# EAGLE design JFETTester (EAGLE 6.4)
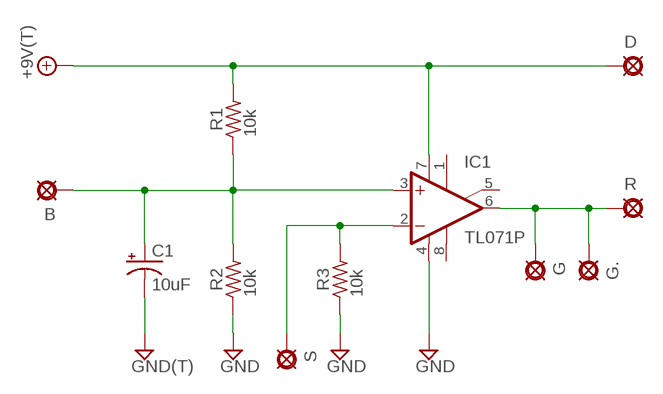
[diagram p0: schematic, sheet 1]

## Parts
+9V  +9V(T)  [SQUARE]
B  PAD  [SQUARE]
C1  10uF  0501  [050_020_1]
D  PAD  [SQUARE]
G  PAD  [SQUARE]
G.  PAD  [SQUARE]
GND  GND(T)  [SQUARE]
IC1  TL071P  [DIL08]
R  PAD  [SQUARE]
R1  10k  6MM.1  [R0207/1V]
R2  10k  6MM.1  [R0207/1V]
R3  10k  6MM.1  [R0207/1V]
S  PAD  [SQUARE]

## Nets
+9V: +9V.1(+9V) D.1(PAD) IC1.7(V+) R1.2
GND: C1.- GND.1(GND) IC1.4(V-) R2.1 R3.1
N$1: B.1(PAD) C1.+ IC1.3(+IN) R1.1 R2.2
N$2: IC1.2(-IN) R3.2 S.1(PAD)
N$3: G.1(PAD) G..1(PAD) IC1.6(OUT) R.1(PAD)
Unconnected: IC1.1(ON1) IC1.5(ON2) IC1.8(OPT)

## Library data of the parts
+9V = mb_supply:+9V(T): +9V Voltage Supply use this to hook up +9v throughout a schematic instead of running wire automatically labels the net "+9v" adds a hookup pad to the circuit board
B D G G. R S = mb_supply:PAD: PAD use this package for pads with any purpose, including input, output, send or return various pad shapes: round, square, octogonal, long, and long offset
C1 = mb_caps-electro:050: 0.22 - 100uF Xicon values at Mouser.com: 10V: 10 - 100uF; 16V: 2.2 - 47uF; 25V: 0.47 - 47uF; 50V: 0.22 - 22uF
GND = mb_supply:GND(T): Ground use this to hook up ground (GND) throughout a schematic instead of running wire automatically labels the net "GND" adds a hookup pad to the circuit board (you can use several)
IC1 = mb_ics:TL071: OP AMP
R1-R3 = mb_resistors:6MM: 6mm Resistors Leads spaced 1-6 holes apart for 0.1" perfboard. Suitable for 1/4 watt resistors.

## Board
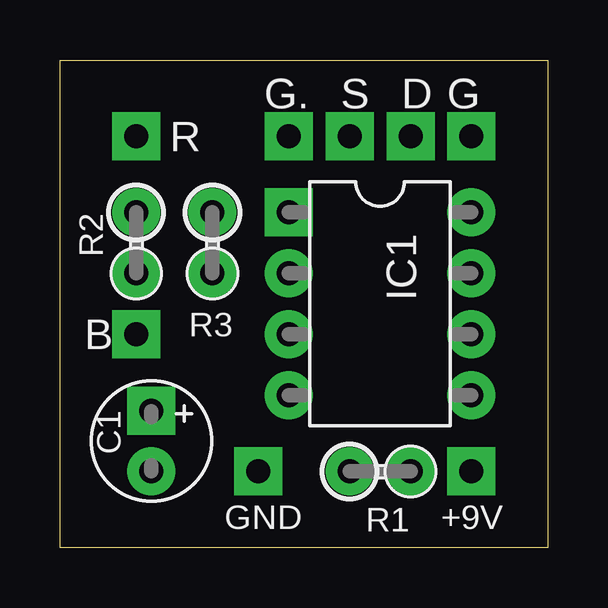
[diagram p1: board, top side]
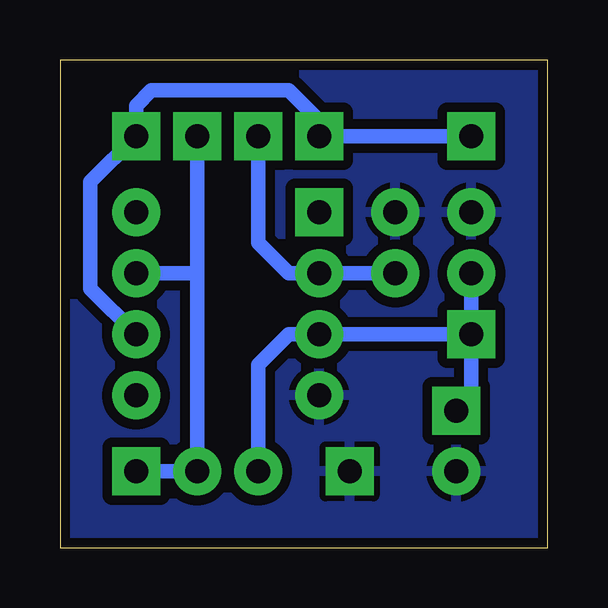
[diagram p2: board, bottom side, seen from below]

Size 20.32 x 20.32 mm. Coordinates in mm from the lower left corner, seen from the top.
Outline: 0,0 0,20.32 20.32,20.32 20.32,0 0,0
Copper layers (1*16): Top 0.0356mm / dielectric 1.5011mm / Bottom 0.0356mm
Design rules "LaenPCBOrder": minimum track width 6mil, minimum drill 13mil, track to track 6mil, track to pad 6mil, pad to pad 6mil, via to via 6mil, smd to smd 6mil, copper to edge 15mil, drill to drill 6mil, minimum pad ring 7mil, minimum via ring 7mil, stop-mask expansion 3mil, vias tented up to drill 0mil, thermal gap 10mil

### Footprints (pad centres in the part's own frame; a part is rotated, then mirrored left to right if it is on the bottom)
SQUARE = drill 1 pad 2 square: 1 0,0
050_020_1 = drill 1 pad 2 square: + -1.27,0 | drill 1 pad 2: - 1.27,0
DIL08 = drill 1 pad 2 square: 1 -3.81,-3.81 | drill 1 pad 2: 2 -1.27,-3.81; 3 1.27,-3.81; 4 3.81,-3.81; 5 3.81,3.81; 6 1.27,3.81; 7 -1.27,3.81; 8 -3.81,3.81
R0207/1V = drill 1 pad 2: 1 -1.27,0; 2 1.27,0

### Placement (x,y rotation side)
+9V  17.15,3.17 0 top
B  3.17,8.89 0 top
C1  3.81,4.45 270 top
D  14.6,17.14 0 top
G  17.15,17.14 0 top
G.  9.52,17.14 0 top
GND  8.25,3.17 0 top
IC1  13.34,10.16 270 top
R  3.17,17.14 0 top
R1  13.34,3.17 0 top
R2  3.17,12.7 270 top
R3  6.35,12.7 270 top
S  12.06,17.14 0 top

### Tracks (layer width: path | path; a pad name or v marks a point on that pad's centre or on a via)
+9V
  Bottom 0.61: 14.6,11.43 R1.2 +9V.1 | 14.6,11.43 D.1 | IC1.7 14.6,11.43
GND
  pour Bottom (isolate 0.406): 0,20.32 20.32,20.32 20.32,0 0,0
N$1
  Bottom 0.61: C1.+ 3.17,6.35 B.1 | R2.2 B.1 | R1.1 12.06,7.62 10.79,8.89 IC1.3 B.1
N$2
  Bottom 0.61: S.1 12.06,12.7 10.79,11.43 IC1.2 R3.2
N$3
  Bottom 0.61: R.1 G..1 9.52,17.78 10.79,19.05 16.51,19.05 17.15,18.41 G.1 19.05,15.24 19.05,10.8 IC1.6